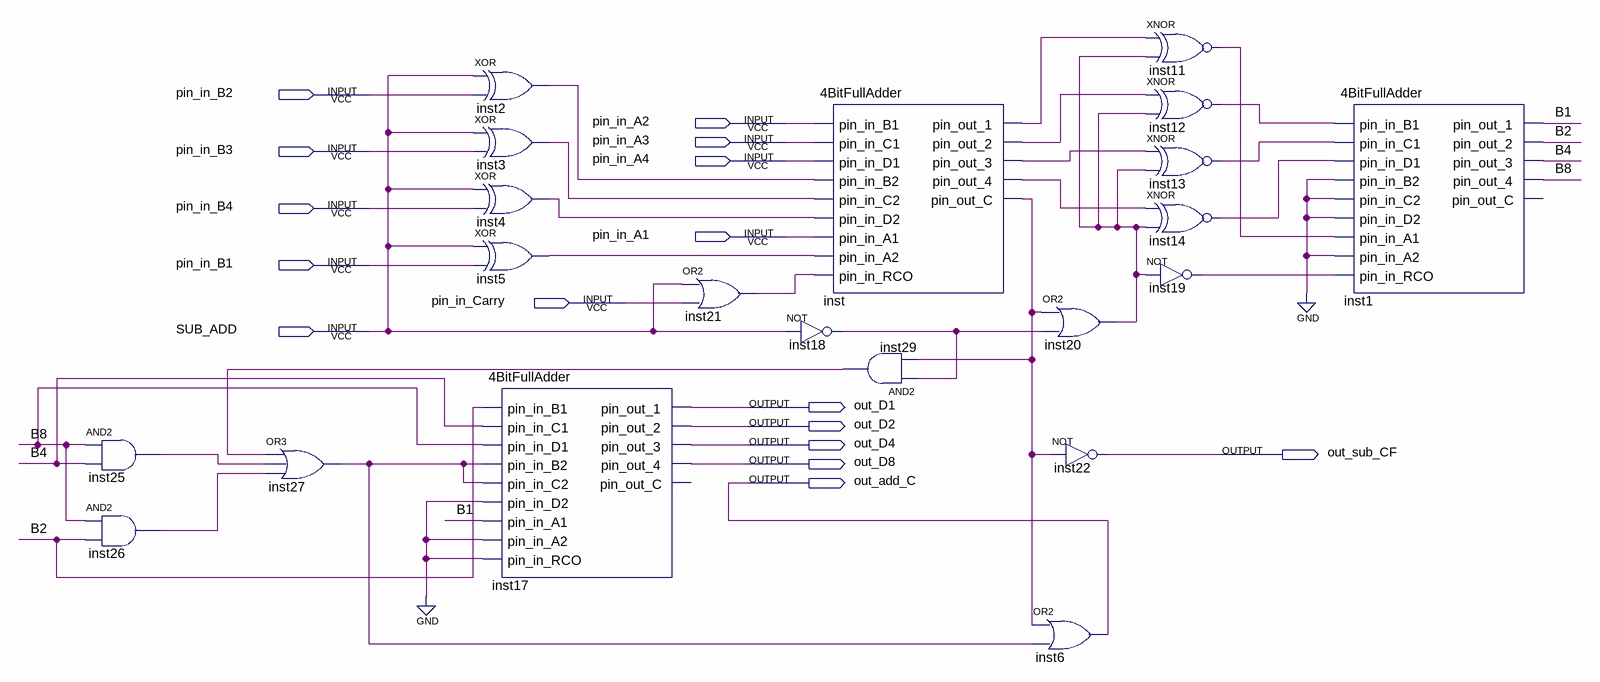
[diagram p0: schematic sheet]
// Quartus schematic BCD_Calculator.bdf as structural Verilog: 21 symbols, 16 pins
module BCD_Calculator (
  input  pin_in_B2,
  input  pin_in_A2,
  input  pin_in_A3,
  input  pin_in_B3,
  input  pin_in_A4,
  input  pin_in_B4,
  input  pin_in_A1,
  input  pin_in_B1,
  input  pin_in_Carry,
  input  SUB_ADD,
  output out_D1,
  output out_D2,
  output out_D4,
  output out_sub_CF,
  output out_D8,
  output out_add_C
);

  wire B1, B2, B4, B8, inst2_out, inst3_out, inst4_out, inst5_out, inst11_out, inst12_out, inst13_out,
       inst14_out, inst18_out, inst19_out, inst20_out, inst21_out, inst25_out, inst26_out, inst27_out,
       inst29_out, inst_pin_out_1, inst_pin_out_2, inst_pin_out_3, inst_pin_out_4, inst_pin_out_c;

  and inst25 (inst25_out, B8, B4);
  and inst26 (inst26_out, B8, B2);
  or inst27 (inst27_out, inst29_out, inst25_out, inst26_out);
  xor inst2 (inst2_out, SUB_ADD, pin_in_B2);
  xor inst3 (inst3_out, SUB_ADD, pin_in_B3);
  xor inst4 (inst4_out, SUB_ADD, pin_in_B4);
  xor inst5 (inst5_out, SUB_ADD, pin_in_B1);
  \4BitFullAdder  inst17 (
    .pin_in_B1(B2), .pin_in_C1(B4), .pin_in_D1(B8), .pin_in_B2(inst27_out), .pin_in_C2(inst27_out),
    .pin_in_D2(1'b0), .pin_in_A1(B1), .pin_in_A2(1'b0), .pin_in_RCO(1'b0), .pin_out_1(out_D1),
    .pin_out_2(out_D2), .pin_out_3(out_D4), .pin_out_4(out_D8));  // open: pin_out_C
  or inst21 (inst21_out, SUB_ADD, pin_in_Carry);
  \4BitFullAdder  inst (
    .pin_in_B1(pin_in_A2), .pin_in_C1(pin_in_A3), .pin_in_D1(pin_in_A4), .pin_in_B2(inst2_out),
    .pin_in_C2(inst3_out), .pin_in_D2(inst4_out), .pin_in_A1(pin_in_A1), .pin_in_A2(inst5_out),
    .pin_in_RCO(inst21_out), .pin_out_1(inst_pin_out_1), .pin_out_2(inst_pin_out_2),
    .pin_out_3(inst_pin_out_3), .pin_out_4(inst_pin_out_4), .pin_out_C(inst_pin_out_c));
  not inst18 (inst18_out, SUB_ADD);
  and inst29 (inst29_out, inst18_out, inst_pin_out_c);
  or inst20 (inst20_out, inst_pin_out_c, inst18_out);
  not inst22 (out_sub_CF, inst_pin_out_c);
  or inst6 (out_add_C, inst_pin_out_c, inst27_out);
  xnor inst11 (inst11_out, inst_pin_out_1, inst20_out);
  xnor inst12 (inst12_out, inst_pin_out_2, inst20_out);
  xnor inst13 (inst13_out, inst_pin_out_3, inst20_out);
  xnor inst14 (inst14_out, inst_pin_out_4, inst20_out);
  not inst19 (inst19_out, inst20_out);
  \4BitFullAdder  inst1 (
    .pin_in_B1(inst12_out), .pin_in_C1(inst13_out), .pin_in_D1(inst14_out), .pin_in_B2(1'b0),
    .pin_in_C2(1'b0), .pin_in_D2(1'b0), .pin_in_A1(inst11_out), .pin_in_A2(1'b0), .pin_in_RCO(inst19_out),
    .pin_out_1(B1), .pin_out_2(B2), .pin_out_3(B4), .pin_out_4(B8));  // open: pin_out_C
endmodule
